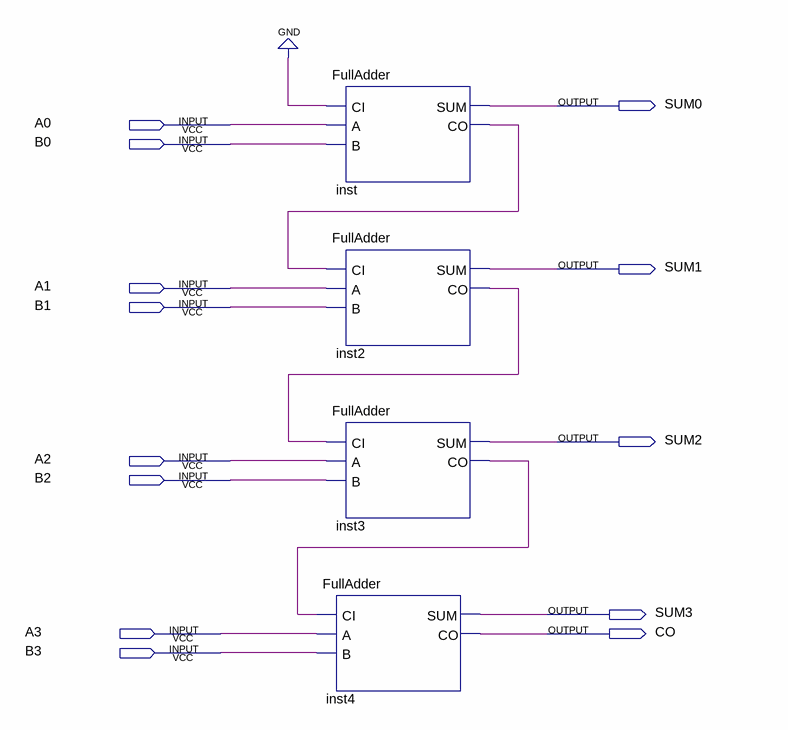
[diagram p0: schematic sheet]
// Quartus schematic RippleCarryAdder.bdf as structural Verilog: 4 symbols, 13 pins
module RippleCarryAdder (
  input  A0,
  input  B0,
  input  A1,
  input  B1,
  input  A2,
  input  B2,
  input  A3,
  input  B3,
  output SUM0,
  output SUM1,
  output SUM2,
  output SUM3,
  output CO
);

  wire inst2_co, inst3_co, inst_co;

  FullAdder inst (.CI(1'b0), .A(A0), .B(B0), .SUM(SUM0), .CO(inst_co));
  FullAdder inst2 (.CI(inst_co), .A(A1), .B(B1), .SUM(SUM1), .CO(inst2_co));
  FullAdder inst3 (.CI(inst2_co), .A(A2), .B(B2), .SUM(SUM2), .CO(inst3_co));
  FullAdder inst4 (.CI(inst3_co), .A(A3), .B(B3), .SUM(SUM3), .CO(CO));
endmodule
